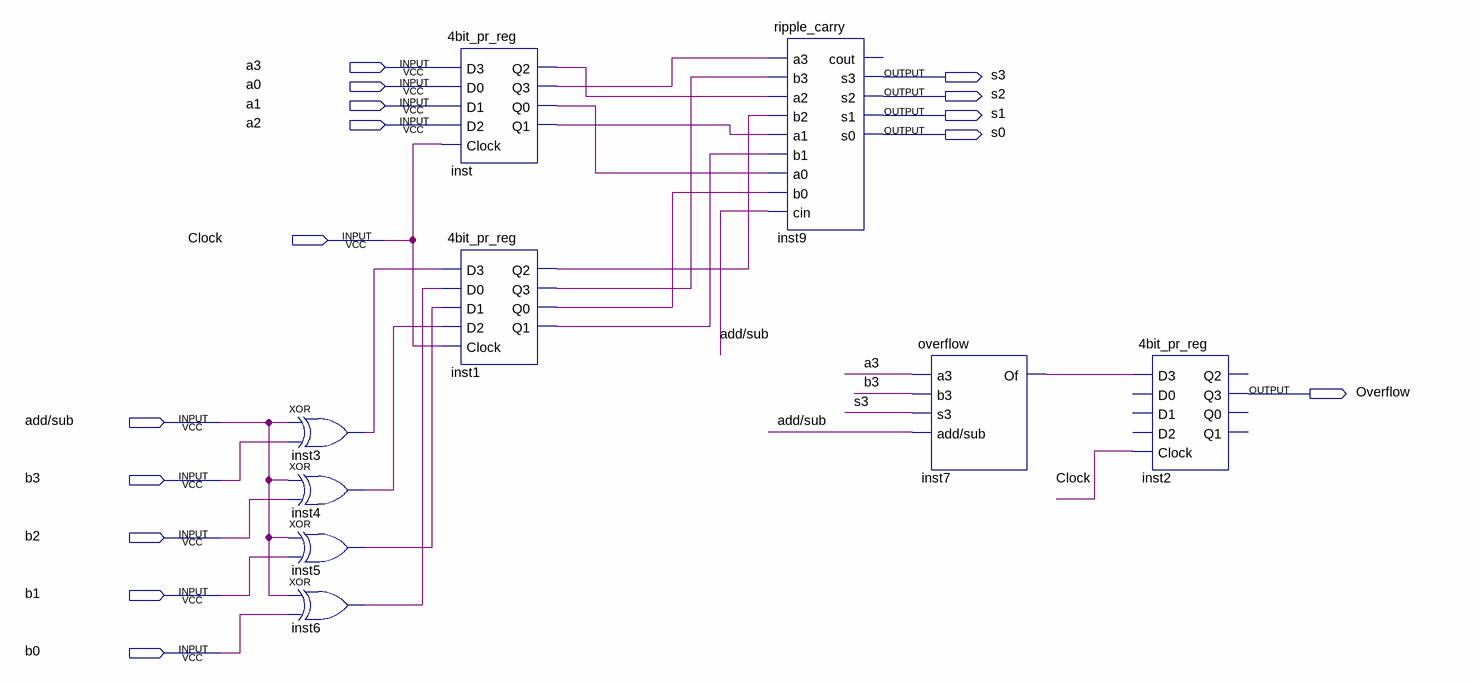
[diagram p0: schematic sheet]
// Quartus schematic Aadd_subB.bdf as structural Verilog: 9 symbols, 15 pins
module Aadd_subB (
  input  a3,
  input  a0,
  input  a1,
  input  a2,
  input  Clock,
  input  \add/sub ,
  input  b3,
  input  b2,
  input  b1,
  input  b0,
  output s3,
  output s2,
  output s1,
  output s0,
  output Overflow
);

  wire inst1_q0, inst1_q1, inst1_q2, inst1_q3, inst3_out, inst4_out, inst5_out, inst6_out, inst7_of, inst_q0,
       inst_q1, inst_q2, inst_q3;

  xor inst3 (inst3_out, \add/sub , b3);
  xor inst4 (inst4_out, \add/sub , b2);
  xor inst5 (inst5_out, \add/sub , b1);
  xor inst6 (inst6_out, \add/sub , b0);
  \4bit_pr_reg  inst (
    .D3(a3), .D0(a0), .D1(a1), .D2(a2), .Clock(Clock), .Q2(inst_q2), .Q3(inst_q3), .Q0(inst_q0), .Q1(inst_q1));
  \4bit_pr_reg  inst1 (
    .D3(inst3_out), .D0(inst6_out), .D1(inst5_out), .D2(inst4_out), .Clock(Clock), .Q2(inst1_q2),
    .Q3(inst1_q3), .Q0(inst1_q0), .Q1(inst1_q1));
  ripple_carry inst9 (
    .a3(inst_q3), .b3(inst1_q3), .a2(inst_q2), .b2(inst1_q2), .a1(inst_q1), .b1(inst1_q1), .a0(inst_q0),
    .b0(inst1_q0), .cin(\add/sub ), .s3(s3), .s2(s2), .s1(s1), .s0(s0));  // open: cout
  overflow inst7 (.a3(a3), .b3(b3), .s3(s3), .\add/sub (\add/sub ), .Of(inst7_of));
  \4bit_pr_reg  inst2 (.D3(inst7_of), .Clock(Clock), .Q3(Overflow));  // open: D0, D1, D2, Q2, Q0, Q1
endmodule
